# Altium schematic sheet Weather station.SchDoc
size A
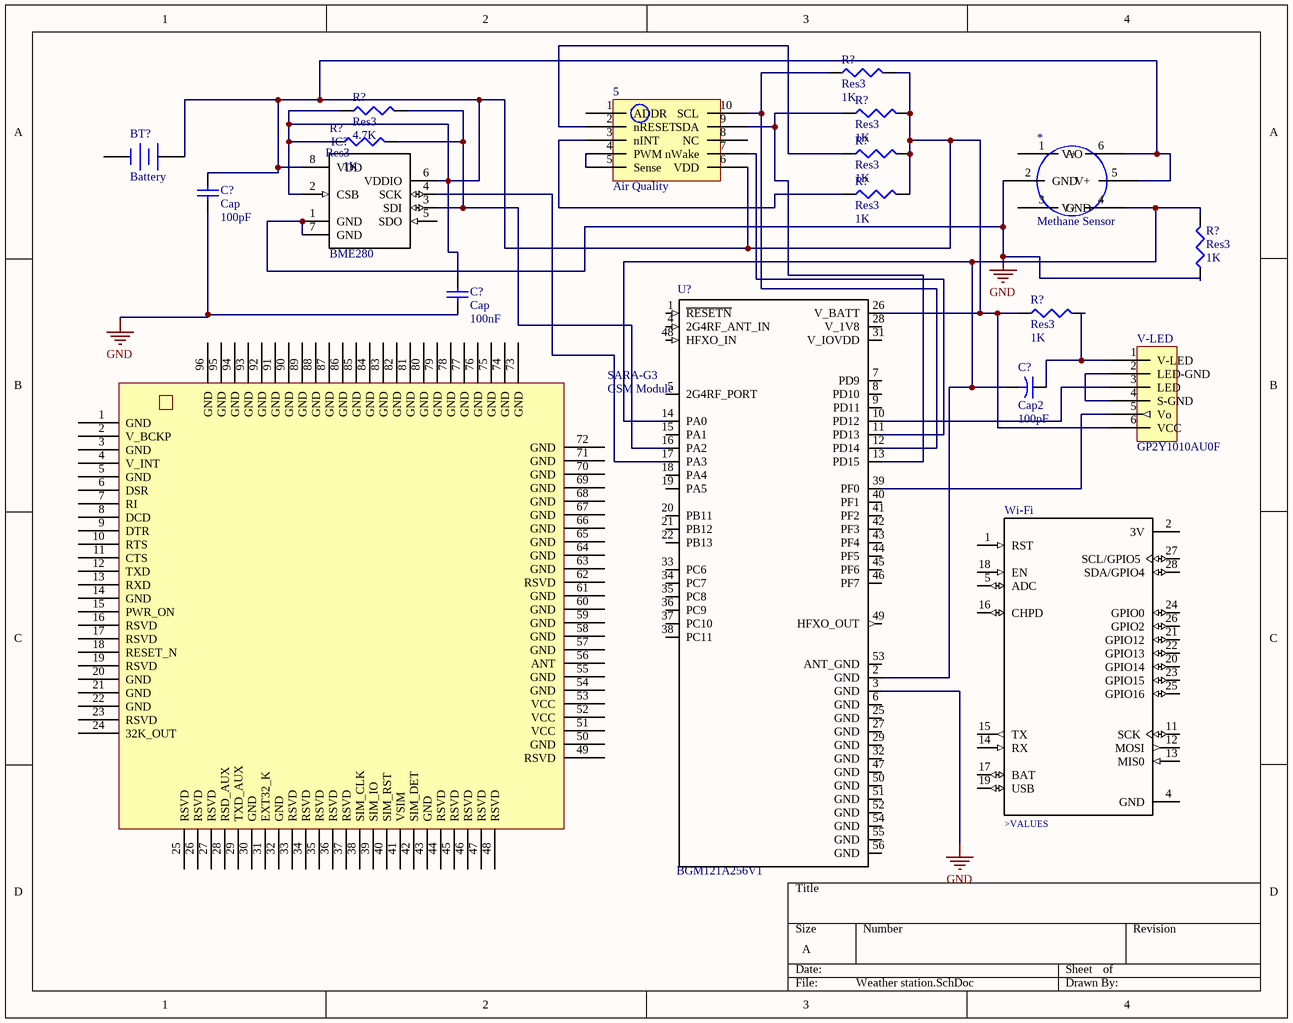
[diagram p0: Weather station.SchDoc]

## Parts
(Parts that share a designator on the sheet are numbered #1, #2 ... from top to bottom, then left to right.)
5  Air Quality
*  Methane Sensor
BT?  Battery  [BAT-2]
C?#1  Cap  value 100pF  [RAD-0.3]
C?#2  Cap  value 100nF  [RAD-0.3]
C?#3  Cap2  value 100pF  [CAPR5-4X5]
IC?  BME280  [BME280]
R?#1  Res3  value 1K  [J1-0603]
R?#2  Res3  value 4.7K  [J1-0603]
R?#3  Res3  value 1K  [J1-0603]
R?#4  Res3  value 1K  [J1-0603]
R?#5  Res3  value 1K  [J1-0603]
R?#6  Res3  value 1K  [J1-0603]
R?#7  Res3  value 1K  [J1-0603]
R?#8  Res3  value 1K  [J1-0603]
SARA-G3  GSM Module
U?  BGM121A256V1  [XCVR_BGM121A256V1]
V-LED  GP2Y1010AU0F
Wi-Fi  2821  [XCVR_2821]  (value not drawn)

## Nets
GND: *.2(GND) C?#1.1 C?#2.1 IC?.1(GND) IC?.7(GND) R?#7.1 U?.3(GND)
Net5_2: 5.2(nRESET) R?#5.1
Net5_3: 5.3(nINT) R?#6.1
Net5_4: 5.4(PWM) 5.5(Sense)
Net5_6: 5.6(VDD) *.5(V+) *.6(V+) BT?.1(+) C?#1.2 C?#2.2 IC?.2(CSB) IC?.6(VDDIO) IC?.8(VDD) R?#1.2 R?#2.1 R?#3.2 R?#4.1 R?#5.2 R?#6.2 R?#8.1 U?.26(V_BATT) V-LED.6(VCC)
Net5_7: 5.7(nWake) U?.11(PD13)
Net5_9: 5.9(SDA) R?#3.1 U?.13(PD15)
Net5_10: 5.10(SCL) R?#1.1 U?.12(PD14)
Net*_4: *.4(V+) C?#3.2 R?#7.2 U?.2(GND) U?.14(PA0)
NetC?#3_1: C?#3.1 R?#8.2 V-LED.1(V-LED)
NetIC?_3: IC?.3(SDI) R?#2.2 R?#4.2 U?.16(PA2)
NetIC?_4: IC?.4(SCK) U?.17(PA3)
NetU?_10: U?.10(PD12) V-LED.3(LED)
NetU?_39: U?.39(PF0) V-LED.5(Vo)
NetV-LED_2: V-LED.2(LED-GND) V-LED.4(S-GND)

Not connected (* = marked no-connect by the designer): 5 1(ADDR) 8(NC); * 1(AO) 3(GND); BT? 2(-); IC? 5(SDO); SARA-G3 1(GND) 2(V_BCKP) 3(GND) 4(V_INT) 5(GND) 6(DSR) 7(RI) 8(DCD) 9(DTR) 10(RTS) 11(CTS) 12(TXD) 13(RXD) 14(GND) 15(PWR_ON) 16(RSVD) 17(RSVD) 18(RESET_N) 19(RSVD) 20(GND) 21(GND) 22(GND) 23(RSVD) 24(32K_OUT) 25(RSVD) 26(RSVD) 27(RSVD) 28(RSD_AUX) 29(TXD_AUX) 30(GND) 31(EXT32_K) 32(GND) 33(RSVD) 34(RSVD) 35(RSVD) 36(RSVD) 37(RSVD) 38(SIM_CLK) 39(SIM_IO) 40(SIM_RST) 41(VSIM) 42(SIM_DET) 43(GND) 44(RSVD) 45(RSVD) 46(RSVD) 47(RSVD) 48(RSVD) 49(RSVD) 50(GND) 51(VCC) 52(VCC) 53(VCC) 54(GND) 55(GND) 56(ANT) 57(GND) 58(GND) 59(GND) 60(GND) 61(GND) 62(RSVD) 63(GND) 64(GND) 65(GND) 66(GND) 67(GND) 68(GND) 69(GND) 70(GND) 71(GND) 72(GND) 73(GND) 74(GND) 75(GND) 76(GND) 77(GND) 78(GND) 79(GND) 80(GND) 81(GND) 82(GND) 83(GND) 84(GND) 85(GND) 86(GND) 87(GND) 88(GND) 89(GND) 90(GND) 91(GND) 92(GND) 93(GND) 94(GND) 95(GND) 96(GND); U? 1(~{RESETN}) 4(2G4RF_ANT_IN) 5(2G4RF_PORT) 6(GND) 7(PD9) 8(PD10) 9(PD11) 15(PA1) 18(PA4) 19(PA5) 20(PB11) 21(PB12) 22(PB13) 25(GND) 27(GND) 28(V_1V8) 29(GND) 31(V_IOVDD) 32(GND) 33(PC6) 34(PC7) 35(PC8) 36(PC9) 37(PC10) 38(PC11) 40(PF1) 41(PF2) 42(PF3) 43(PF4) 44(PF5) 45(PF6) 46(PF7) 47(GND) 48(HFXO_IN) 49(HFXO_OUT) 50(GND) 51(GND) 52(GND) 53(ANT_GND) 54(GND) 55(GND) 56(GND); Wi-Fi 1(RST) 2(3V) 4(GND) 5(ADC) 11(SCK) 12(MOSI) 13(MIS0) 14(RX) 15(TX) 16(CHPD) 17(BAT) 18(EN) 19(USB) 20(GPIO14) 21(GPIO12) 22(GPIO13) 23(GPIO15) 24(GPIO0) 25(GPIO16) 26(GPIO2) 27(SCL/GPIO5) 28(SDA/GPIO4)

## Notes on the sheet
- (in symbol 2821) >VALUES

## Library data of the parts
* = Dust Sensor
BT? = Battery: Multicell Battery; Published: 24-Mar-1999; LatestRevisionDate: 17-Jul-2002; LatestRevisionNote: Re-released for DXP Platform.; PackageReference: BAT-2; Publisher: Altium Limited; PackageDescription: Battery; 2 Leads
C?#1 C?#2 = Cap: Capacitor; Published: 8-Jun-2000; LatestRevisionDate: 17-Jul-2002; LatestRevisionNote: Re-released for DXP Platform.; PackageReference: RAD-0.3; Publisher: Altium Limited; PackageDescription: Radial Cap, Thru-Hole; 2 Leads; 0.3 in Pin Spacing
C?#3 = Cap2: Capacitor; Published: 23-Sep-2002; PackageReference: CAPR5-4X5; Publisher: Altium Limited; PackageDescription: Capacitor; 2 Leads
IC? = BME280: SENSOR PRESSURE HUMIDITY TEMP; MF: Bosch; Price: 5.55 USD; Package: LGA-8 Bosch; MP: BME280; Availability: Good; Value: *
R?#1-R?#8 = Res3: Resistor; Published: 8-Jun-2000; LatestRevisionDate: 29-May-2009; LatestRevisionNote: IPC-7351 Footprint Added.; PackageReference: J1-0603; Publisher: Altium Limited; PackageDescription: Chip Resistor
U? = BGM121A256V1: BGM121 Bluetooth SIP Module, 8 dBm TX with antenna. Tray.; MF: Silicon Labs; MP: BGM121A256V1; Price: 9.97 USD; Package: Module Silicon Labs; Availability: Bad; Value: *
Wi-Fi = 2821: ESP8266 FEATHER HUZZAH LOOSE HDR; MF: Adafruit Industries; Package: None; MP: 2821; Price: 17.13 USD; Availability: Warning; Value: *